# EAGLE design SRD-05VDC-SL-c Breakout (EAGLE 6.5.0)
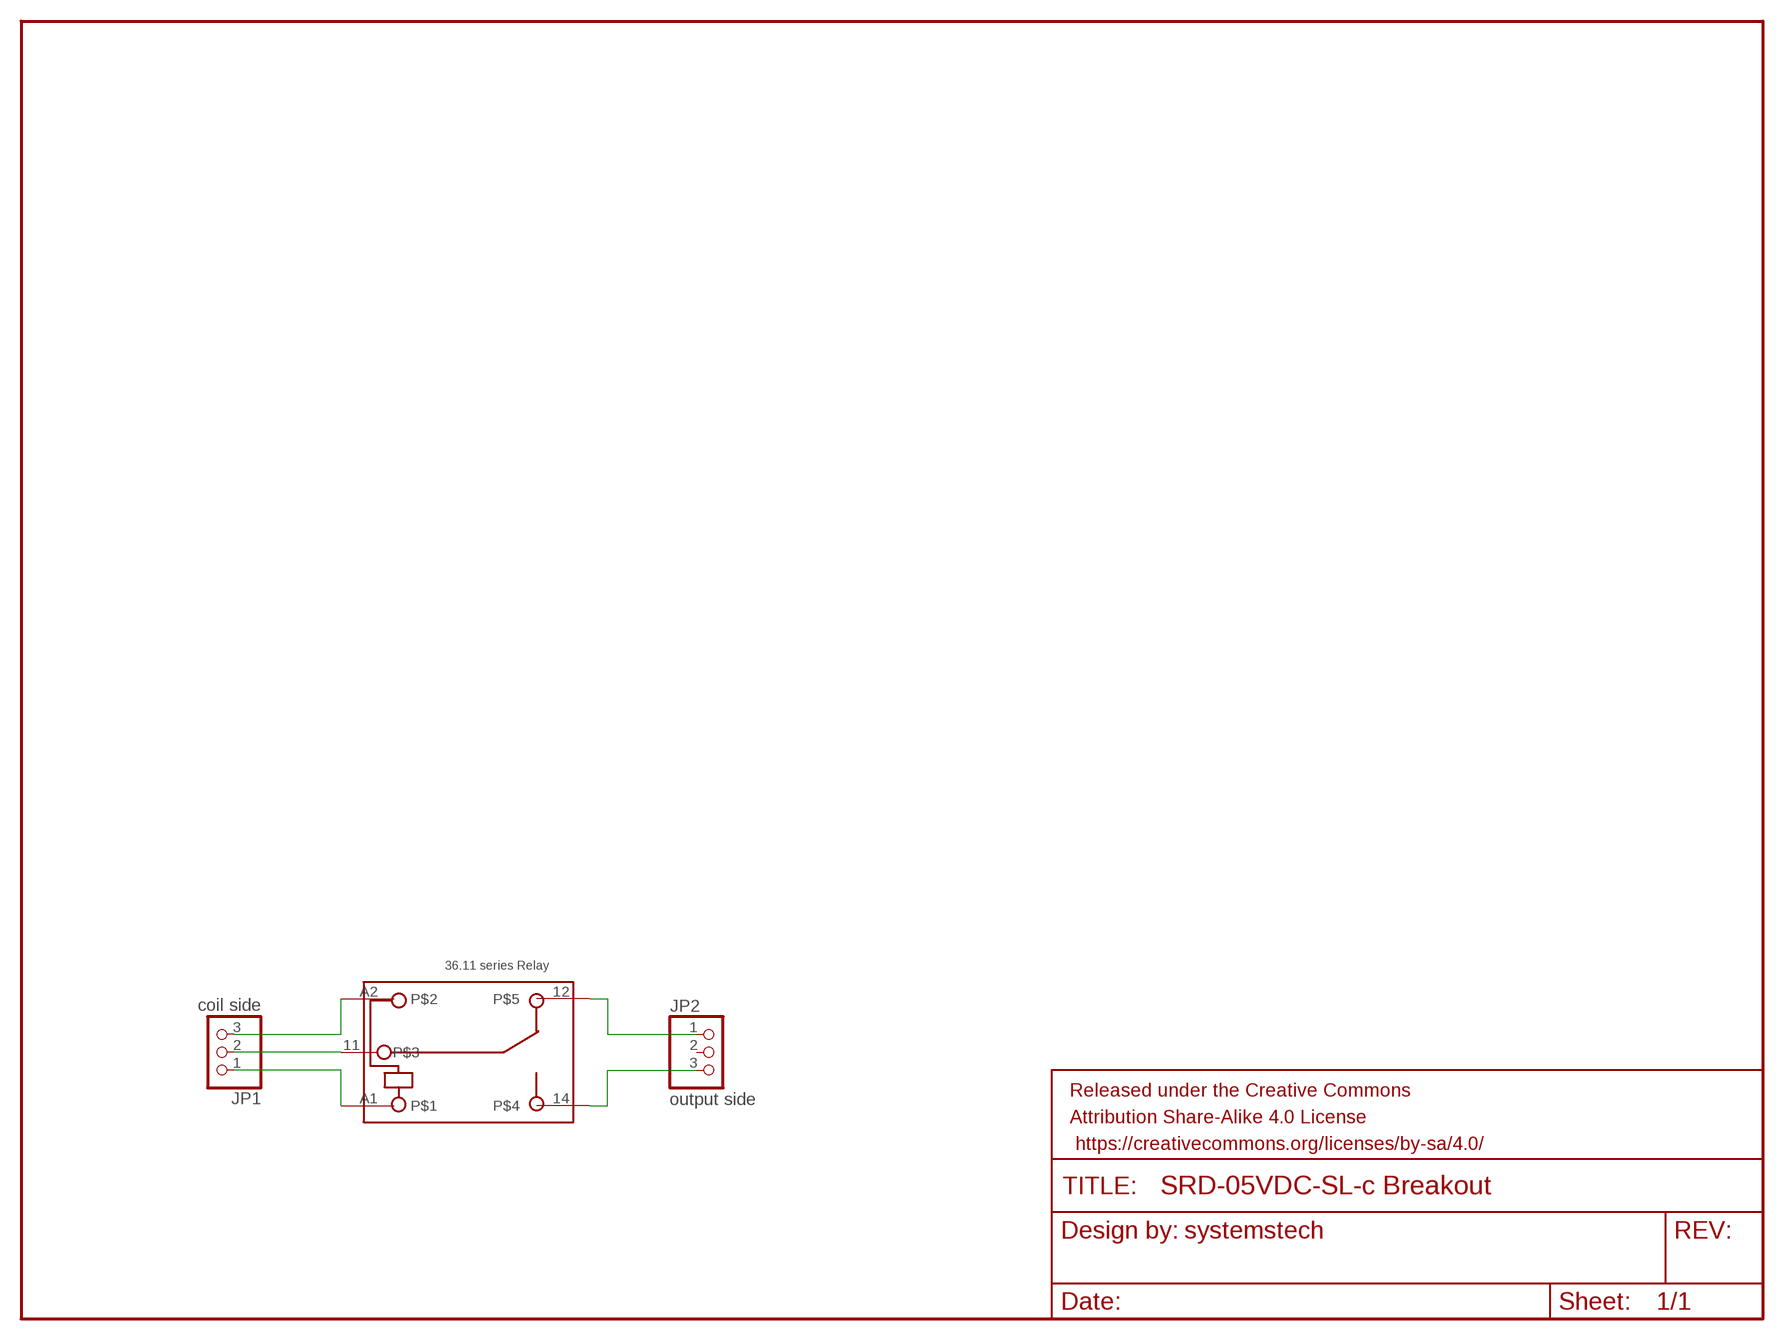
[diagram p0: schematic, sheet 1]

## Parts
FRAME1  FRAME-LETTER  [CREATIVE_COMMONS]
JP1  coil side  PINHD-1X3  [1X03]
JP2  output side  PINHD-1X3  [1X03]
K1  36.11  [36.11]

## Nets
N$1: JP1.3 K1.A2
N$2: JP1.2 K1.11
N$3: JP1.1 K1.A1
N$4: JP2.1 K1.12
N$5: JP2.3 K1.14
Unconnected: JP2.2

## Notes on the sheet
- systemstech

## Library data of the parts
FRAME1 = SparkFun-Aesthetics:FRAME-LETTER: Schematic Frame Standard 8.5x11 US Letter frame
JP1 JP2 = adafruit:PINHD-1X3: PIN HEADER
K1 = relay_finder_36_11:36.11: Printed circuit mount miniature 10 A relay one pole changeover contacts Conform RoHS

## Board
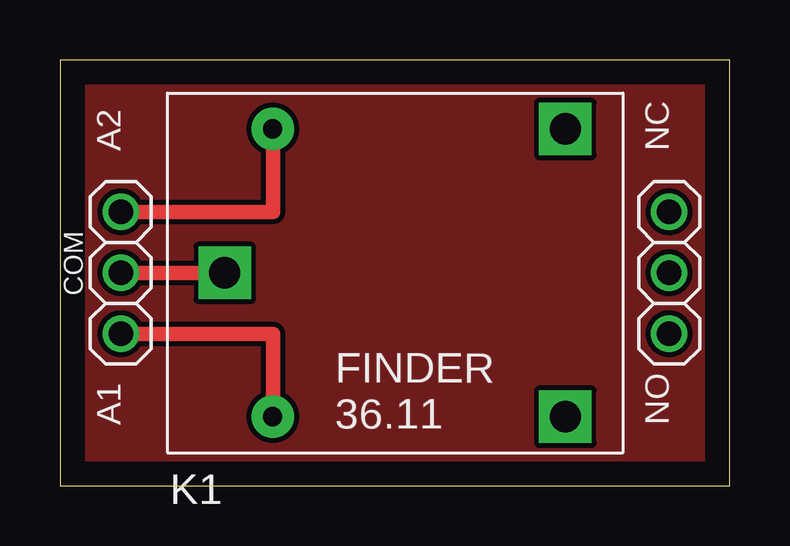
[diagram p1: board, top side]
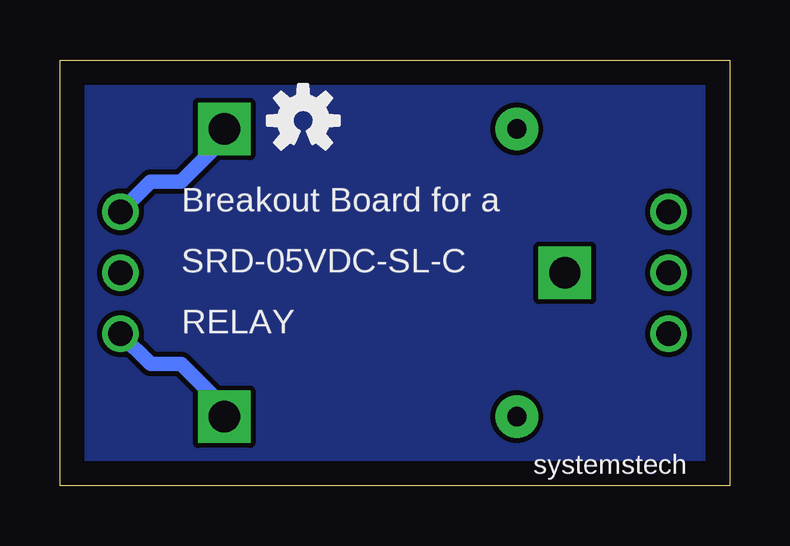
[diagram p2: board, bottom side, seen from below]

Size 27.92 x 17.77 mm. Coordinates in mm from the lower left corner, seen from the top.
Outline: 0,0 27.92,0 27.92,17.77 0,17.77 0,0
Copper layers (1*16): Top 0.035mm / dielectric 1.5mm / Bottom 0.035mm
Design rules "default *": minimum track width 24mil, minimum drill 0.6mm, track to track 8mil, track to pad 8mil, pad to pad 8mil, via to via 8mil, smd to smd 8mil, copper to edge 40mil, drill to drill 8mil, minimum pad ring 10mil, minimum via ring 8mil, stop-mask expansion 4mil, vias tented up to drill 0mil, thermal gap 10mil

### Footprints (pad centres in the part's own frame; a part is rotated, then mirrored left to right if it is on the bottom)
1X03 = drill 1.016: 1 -2.54,0; 2 0,0; 3 2.54,0
36.11 = drill 1.3 pad 2.184 square: 11 -7.1,0; 12 7.1,6; 14 7.1,-6 | drill 0.8 pad 1.778: A1 -5.1,-6; A2 -5.1,6

### Placement (x,y rotation side)
FRAME1  0,-19.05 0 top  (outside the outline)
JP1  2.54,8.89 90 top
JP2  25.4,8.89 270 top
K1  13.97,8.89 0 top
U$1  [CREATIVE_COMMONS]  0,-10.16 0 top  (outside the outline)
U$2  [OSHW-LOGO-S]  17.78,15.24 0 bottom

### Tracks (layer width: path | path; a pad name or v marks a point on that pad's centre or on a via)
GND
  pour Bottom: 0,0 27.94,0 27.94,17.78 0,17.78
  pour Top: 0,0 27.94,0 27.94,17.78 0,17.78
N$1
  Top 0.61: JP1.3 8.89,11.43 8.89,15.24 K1.A2
N$2
  Top 0.61: K1.11 JP1.2
N$3
  Top 0.61: JP1.1 8.89,6.35 8.89,2.54 K1.A1
N$4
  Bottom 0.61: JP2.1 24.13,12.7 22.86,12.7 21.59,13.97 K1.12
N$5
  Bottom 0.61: JP2.3 24.13,5.08 22.86,5.08 21.59,3.81 K1.14

### Text on the board
Document: systemstech
_tsilk: A2 | NC | COM | A1 | NO
_bsilk: Breakout Board for a | SRD-05VDC-SL-C | RELAY | systemstech